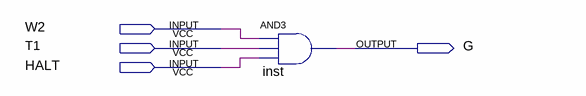
[diagram p0: schematic sheet]
// Quartus schematic G.bdf as structural Verilog: 1 symbols, 4 pins
module G (
  input  W2,
  input  T1,
  input  HALT,
  output G
);

  and inst (G, W2, T1, HALT);
endmodule
